# Altium schematic sheet 5kW Sensor.SchDoc
size A4
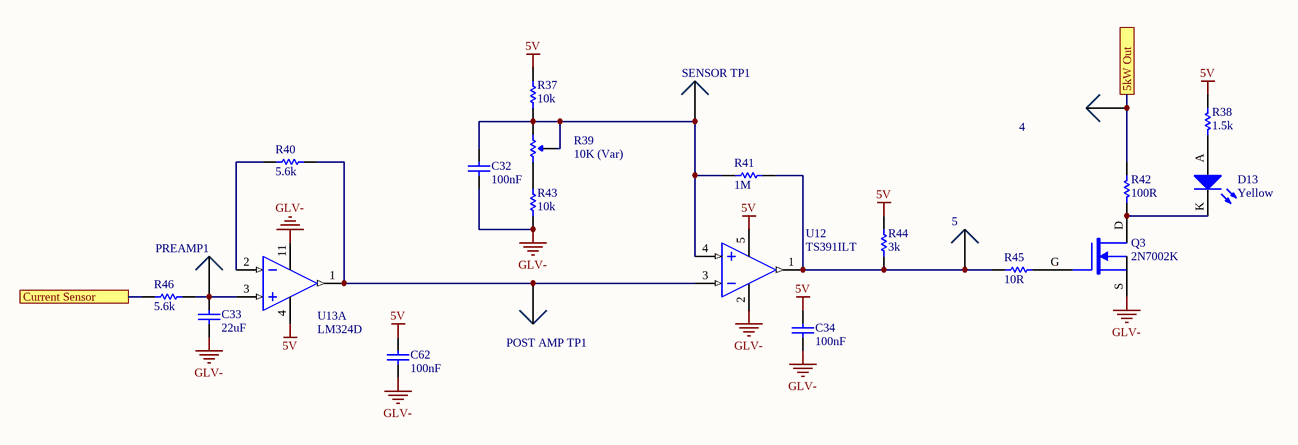
[diagram p0: 5kW Sensor.SchDoc]

## Parts
4  0mm  [TH Test Point]  (value not drawn)
5  0mm  [TH Test Point]  (value not drawn)
C32  100nF  [0805]
C33  22uF  [0805]
C34  100nF  [0805]
C62  100nF  [0805]
D13  Yellow  [0805 LED]
POST_AMP_TP1  0mm  [TH Test Point]  (value not drawn)
PREAMP1  0mm  [TH Test Point]  (value not drawn)
Q3  2N7002K  [ON SOT-23 MOSFET]
R37  10k  [0805]
R38  1.5k  [0805]
R39  10K (Var)  [B 3296]
R40  5.6k  [0805]
R41  1M  [0805]
R42  100R  [0805]
R43  10k  [0805]
R44  3k  [0805]
R45  10R  [0805]
R46  5.6k  [0805]
SENSOR_TP1  0mm  [TH Test Point]  (value not drawn)
U12  TS391ILT  [ON SOT-23-5]
U13  LM324D  [TI 14-SOIC]  (part A of 4)

## Ports
5kW Out, Current Sensor

## Nets
5V: C34.2 C62.2 R37.2 R38.2 R44.2 U12.5(VCC+) U13.4(VCC)
GLV-: C32.1 C33.1 C34.1 C62.1 Q3.S R43.1 U12.2(VCC-) U13.11(GND)
5kW Out: 4.1 R42.2 ; port 5kW Out
Current Sensor: R46.1 ; port Current Sensor
Net5_1: 5.1 R41.2 R44.1 R45.1 U12.1(OUT)
NetC32_2: C32.2 R37.1 R39.1(CCW) R39.2(Wiper) R41.1 SENSOR_TP1.1 U12.4(IIN+)
NetC33_2: C33.2 PREAMP1.1 R46.2 U13.3(1IN+)
NetD13_A: D13.A R38.1
NetD13_K: D13.K Q3.D R42.1
NetPOST_AMP_TP1_1: POST_AMP_TP1.1 R40.2 U12.3(IN-) U13.1(1OUT)
NetQ3_G: Q3.G R45.2
NetR39_3: R39.3(CW) R43.2
NetR40_1: R40.1 U13.2(1IN+)

## Library data of the parts
4 5 POST_AMP_TP1 PREAMP1 SENSOR_TP1 = TH Test Point: Positions: 1; Angle: 0; Flange: No; Contact: NA; Part Number: TH Test Point; Pitch: 0mm; Row Spacing: 0mm
C32 C34 C62 = GCM21BR71E104KA37L: Manufacturer: muRata; Tolerance: 10%; Material: X7R; Rated Voltage: 25V; Part Number: GCM21BR71E104KA37L; Value: 100nF
C33 = GRM21BR61A226ME51L: Manufacturer: muRata; Tolerance: 20%; Material: X5R; Rated Voltage: 10V; Part Number: GRM21BR61A226ME51L; Value: 22uF; Digikey Part Number: 490-10511-1-ND
D13 = SML-211YTT86: Yellow LED Indication - Discrete 1.75V 0805 (2012 Metric); Manufacturer: ROHM Semiconductor; Part Number: SML-211YTT86; Colour: Yellow; Digikey Part Number: 511-1293-1-ND; Digikey Link: https://www.digikey.com/product-detail/en/rohm-semiconductor/SML-211YTT86/511-1293-1-ND/637106
Q3 = 2N7002K: 60V 380mA, NFET MOSTFET (Small Signal); Manufacturer: ON Semiconductor; Published: 24-Mar-1999; LatestRevisionDate: 29-May-2009; LatestRevisionNote: IPC-7351 Footprint Added.; PackageVersion: Sep-2000; PackageReference: SOT-343; Publisher: Altium Limited; PackageDescription: 4-Pin SOT-343 Package 1.3 mm Pitch, 2.1 mm Lead Span; Part Number: 2N7002K; Digikey Part Number: 2N7002KCT-ND; Digikey Link: https://www.digikey.com/product-detail/en/on-semiconductor/2N7002K/2N7002KCT-ND/2060375; Qty: 30
R37 R43 = RC0805FR0710KL: Manufacturer: YAGEO; Tolerance: 0.01; Rated Voltage: 0.125W; Part Number: RC0805FR0710KL; Value: 10k; Material: FR-07
R38 = RC0805FR071K5L: Manufacturer: YAGEO; Tolerance: 0.01; Rated Voltage: 0.125W; Part Number: RC0805FR071K5L; Value: 1.5k; Material: FR-07
R39 = 3296W-1-103LF: Manufacturer: Bournes Inc; Tolerance: 0.1; Rated Voltage: 0.5W; Part Number: 3296W-1-103LF; Value: 10K (Var); Digikey Part Number: 3296W-103LF-ND
R40 R46 = RC0805FR075K6L: Manufacturer: YAGEO; Tolerance: 0.01; Rated Voltage: 0.125W; Part Number: RC0805FR075K6L; Value: 5.6k; Material: FR-07
R41 = RC0805FR071ML: Manufacturer: YAGEO; Tolerance: 0.01; Rated Voltage: 0.125W; Part Number: RC0805FR071ML; Value: 1M; Material: FR-07
R42 = RC0805FR07100RL: Manufacturer: YAGEO; Tolerance: 0.01; Rated Voltage: 0.125W; Part Number: RC0805FR07100RL; Value: 100R; Material: FR-07
R44 = RC0805FR073KL: Manufacturer: YAGEO; Tolerance: 0.01; Rated Voltage: 0.125W; Part Number: RC0805FR073KL; Value: 3k; Material: FR-07
R45 = RC0805FR0710RL: Manufacturer: YAGEO; Tolerance: 0.01; Rated Voltage: 0.125W; Part Number: RC0805FR0710RL; Value: 10R; Material: FR-07
U12 = TS391ILT: IC COMP LO PWR SGL V SOT 23-5L; Manufacturer: STMicroelectronics; Part Number: TS391ILT; Digikey Part Number: 497-2275-2-ND; Digikey Link: https://www.digikey.com/product-detail/en/stmicroelectronics/TS391ILT/497-2275-2-ND/599407
U13 = LM324D: IC OPAMP GP 4 CIRCUIT 14SOIC; Manufacturer: Texas Instruments; Part Number: LM324D; Digikey Part Number: 296-1390-5-ND; Digikey Link: https://www.digikey.com/product-detail/en/texas-instruments/LM324D/296-1390-5-ND/277039